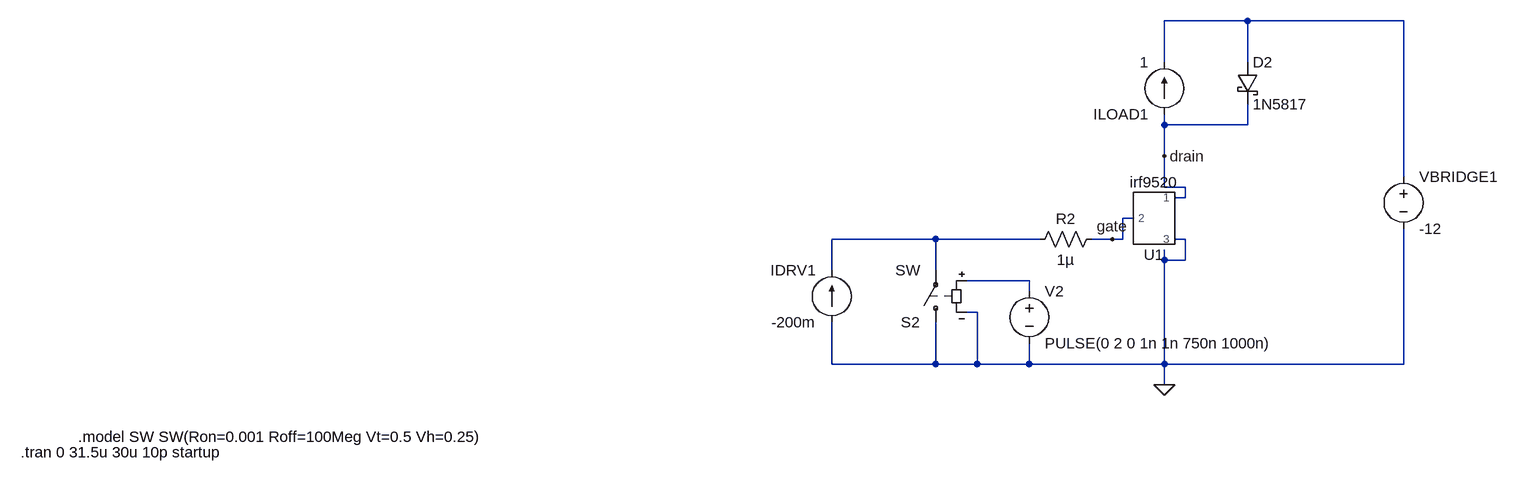
[diagram p0: schematic tb_GateCharge_pmos.asc]
tb_GateCharge_pmos.asc, the LTspice schematic file:
Version 4
SHEET 1 2020 680
WIRE 1632 -208 1504 -208
WIRE 1872 -208 1632 -208
WIRE 1504 -144 1504 -208
WIRE 1632 -144 1632 -208
WIRE 1504 -48 1504 -64
WIRE 1632 -48 1632 -80
WIRE 1632 -48 1504 -48
WIRE 1504 0 1504 -48
WIRE 1872 32 1872 -208
WIRE 1504 48 1504 0
WIRE 1536 48 1504 48
WIRE 1536 64 1536 48
WIRE 1536 64 1520 64
WIRE 1456 96 1440 96
WIRE 1152 128 992 128
WIRE 1312 128 1152 128
WIRE 1424 128 1392 128
WIRE 1440 128 1440 96
WIRE 1440 128 1424 128
WIRE 1536 128 1520 128
WIRE 1504 160 1504 144
WIRE 1536 160 1536 128
WIRE 1536 160 1504 160
WIRE 992 176 992 128
WIRE 1152 176 1152 128
WIRE 1296 192 1200 192
WIRE 1296 208 1296 192
WIRE 1216 240 1200 240
WIRE 992 320 992 256
WIRE 1152 320 1152 256
WIRE 1152 320 992 320
WIRE 1216 320 1216 240
WIRE 1216 320 1152 320
WIRE 1296 320 1296 288
WIRE 1296 320 1216 320
WIRE 1504 320 1504 160
WIRE 1504 320 1296 320
WIRE 1872 320 1872 112
WIRE 1872 320 1504 320
WIRE 1504 352 1504 320
FLAG 1504 352 0
FLAG 1424 128 gate
FLAG 1504 0 drain
SYMBOL current 992 256 R180
WINDOW 0 24 80 Left 2
WINDOW 3 24 0 Left 2
WINDOW 123 0 0 Left 0
WINDOW 39 0 0 Left 0
SYMATTR InstName IDRV1
SYMATTR Value -200m
SYMBOL sw 1152 272 R180
SYMATTR InstName S2
SYMBOL voltage 1296 192 R0
WINDOW 123 0 0 Left 0
WINDOW 39 0 0 Left 0
SYMATTR InstName V2
SYMATTR Value PULSE(0 2 0 1n 1n 750n 1000n)
SYMBOL current 1504 -64 R180
WINDOW 123 0 0 Left 0
WINDOW 39 0 0 Left 0
SYMATTR InstName ILOAD1
SYMATTR Value 1
SYMBOL voltage 1872 16 R0
WINDOW 123 0 0 Left 0
WINDOW 39 0 0 Left 0
SYMATTR InstName VBRIDGE1
SYMATTR Value -12
SYMBOL schottky 1616 -144 R0
SYMATTR InstName D2
SYMATTR Value 1N5817
SYMATTR Description Diode
SYMATTR Type diode
SYMBOL res 1408 112 R90
WINDOW 0 0 56 VBottom 2
WINDOW 3 32 56 VTop 2
SYMATTR InstName R2
SYMATTR Value 1µ
SYMBOL AutoGenerated\\irf9520 1488 96 M180
SYMATTR InstName U1
TEXT -168 432 Left 2 !.model SW SW(Ron=0.001 Roff=100Meg Vt=0.5 Vh=0.25)
TEXT -256 456 Left 2 !.tran 0 31.5u 30u 10p startup

The netlist it stands for:
* tb_GateCharge_pmos.asc
IDRV1 0 N002 -200m
S2 0 N002 N003 0 SW
V2 N003 0 PULSE(0 2 0 1n 1n 750n 1000n)
ILOAD1 drain N001 1
VBRIDGE1 N001 0 -12
D2 N001 drain 1N5817
R2 gate N002 1µ
XU1 drain gate 0 irf9520  ; pins 1 2 3
.model D D
.lib standard.dio
.model SW SW(Ron=0.001 Roff=100Meg Vt=0.5 Vh=0.25)
.tran 0 31.5u 30u 10p startup
.lib sihf9520.txt
.backanno
.end